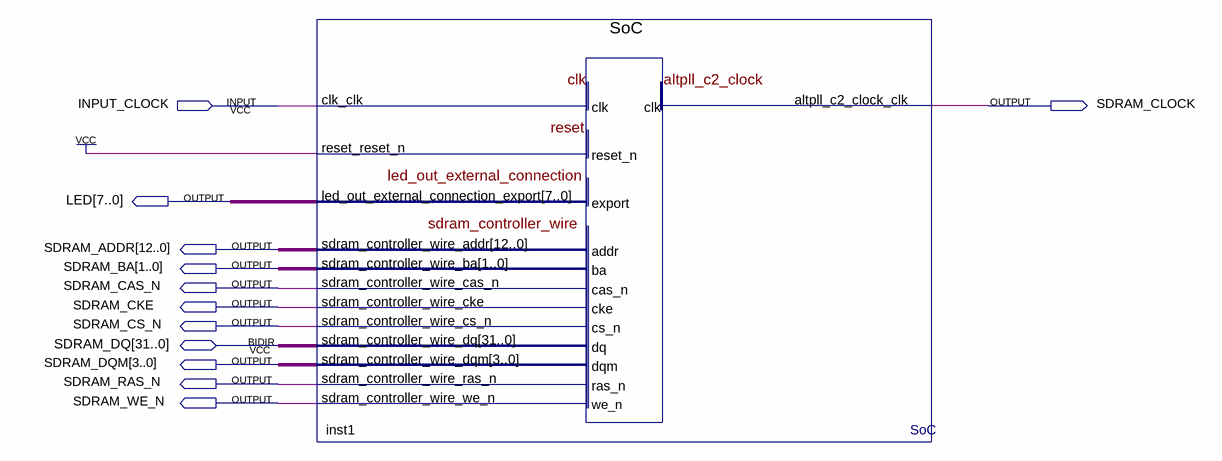
[diagram p0: schematic sheet]
// Quartus schematic TopLevel.bdf as structural Verilog: 1 symbols, 12 pins
module TopLevel (
  input  INPUT_CLOCK,
  inout  [31:0] SDRAM_DQ,
  output SDRAM_CLOCK,
  output [7:0] LED,
  output [12:0] SDRAM_ADDR,
  output [1:0] SDRAM_BA,
  output SDRAM_CAS_N,
  output SDRAM_CKE,
  output SDRAM_CS_N,
  output [3:0] SDRAM_DQM,
  output SDRAM_RAS_N,
  output SDRAM_WE_N
);

  SoC inst1 (
    .clk_clk(INPUT_CLOCK), .reset_reset_n(1'b1), .led_out_external_connection_export(LED),
    .sdram_controller_wire_addr(SDRAM_ADDR), .sdram_controller_wire_ba(SDRAM_BA),
    .sdram_controller_wire_cas_n(SDRAM_CAS_N), .sdram_controller_wire_cke(SDRAM_CKE),
    .sdram_controller_wire_cs_n(SDRAM_CS_N), .sdram_controller_wire_dqm(SDRAM_DQM),
    .sdram_controller_wire_ras_n(SDRAM_RAS_N), .sdram_controller_wire_we_n(SDRAM_WE_N),
    .altpll_c2_clock_clk(SDRAM_CLOCK), .sdram_controller_wire_dq(SDRAM_DQ));
endmodule
